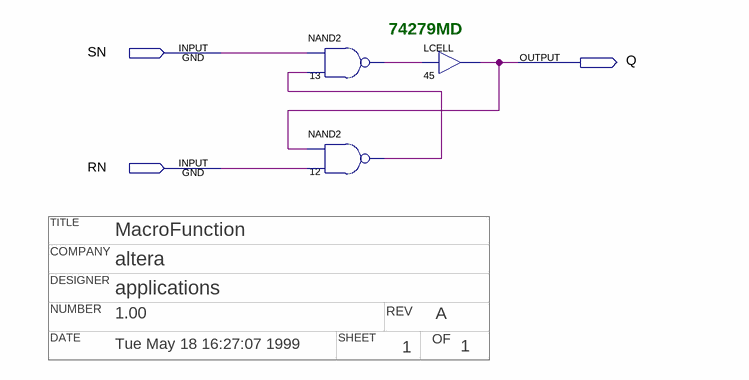
[diagram p0: schematic sheet]
// Quartus schematic 74279md.bdf as structural Verilog: 3 symbols, 3 pins
// Title block: TITLE: MacroFunction; COMPANY: altera; DESIGNER: applications; NUMBER: 1.00; REV: A; DATE: Tue May 18 16:27:07 1999; SHEET: 1; OF: 1
module \74279md  (
  input  SN,
  input  RN,
  output Q
);

  wire n12_out, n13_out;

  nand u_13 (n13_out, SN, n12_out);
  nand u_12 (n12_out, Q, RN);
  LCELL u_45 (.IN(n13_out), .OUT(Q));

  // Notes on the sheet:
  //   74279MD
endmodule
